# Altium project TS_24 Temperature Module.PrjPcb
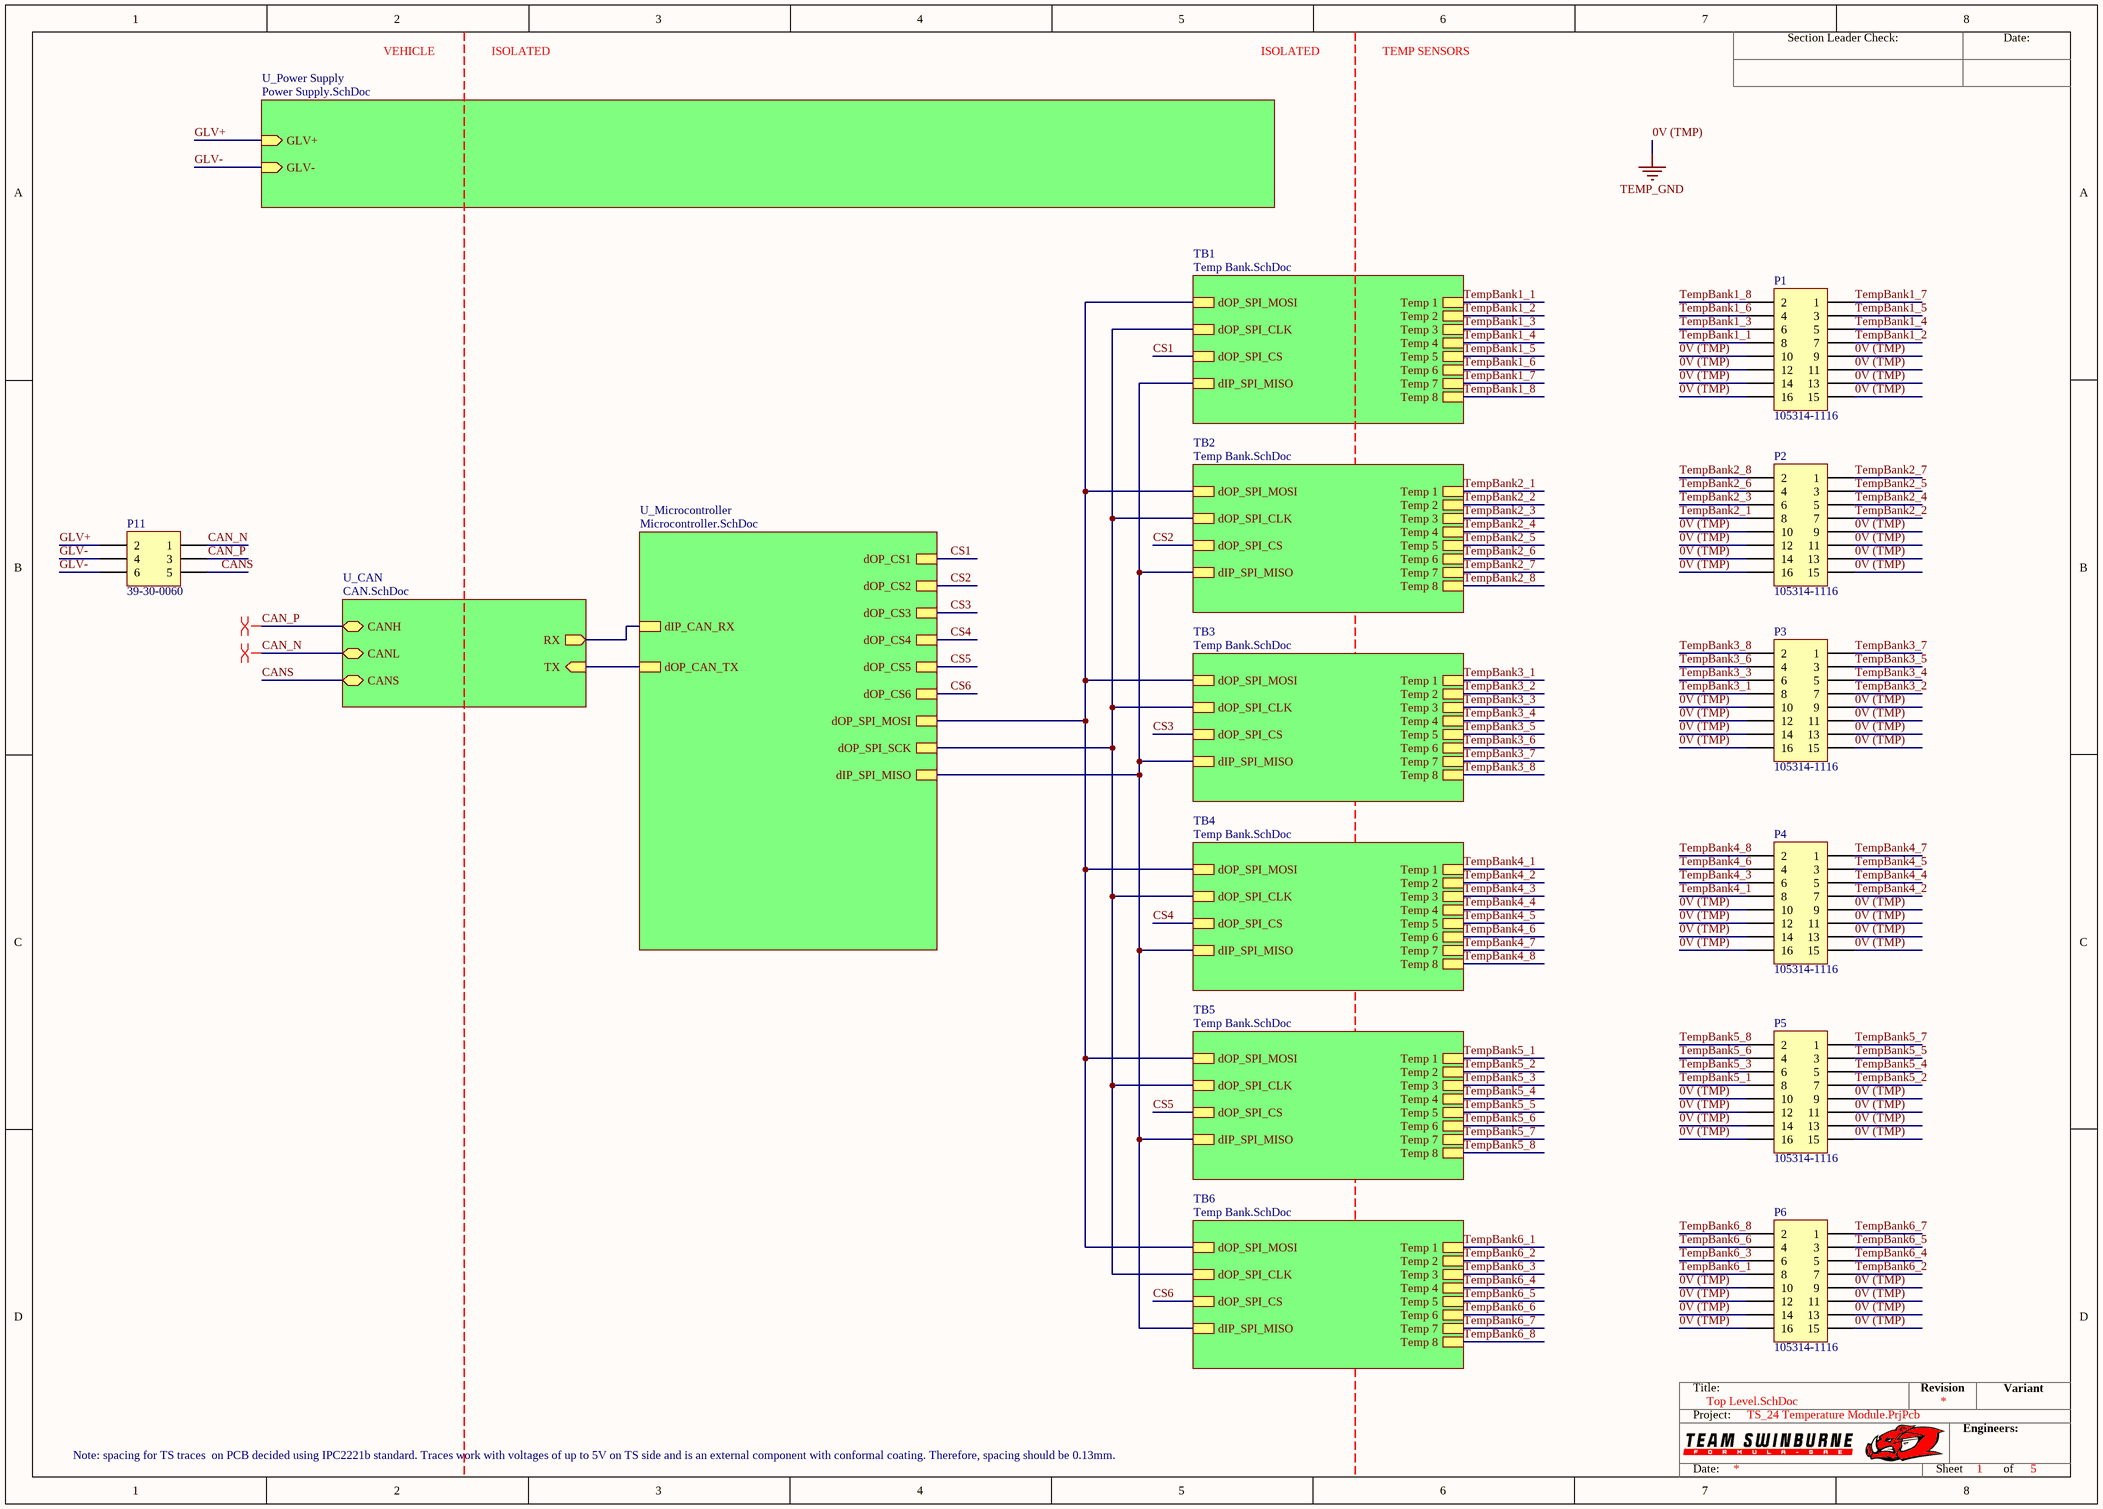
[diagram p0: Top Level.SchDoc]
4 sheets, 59 parts. Net scope: hierarchical (ports join the sheet entries above them; power ports are global).
Board files: Temp Module C1.PcbDoc, Temp Module B1 Sample.PcbDoc
Sheets:
  Top Level.SchDoc
    U_Power Supply = Power Supply.SchDoc
    U_CAN = CAN.SchDoc
    U_Microcontroller = Microcontroller.SchDoc

## Sheet Top Level.SchDoc
size A3; SheetNumber: 1; SheetTotal: 5

### Parts
P1  105314-1116  [105314-1116-Footprint-1]
P2  105314-1116  [105314-1116-Footprint-1]
P3  105314-1116  [105314-1116-Footprint-1]
P4  105314-1116  [105314-1116-Footprint-1]
P5  105314-1116  [105314-1116-Footprint-1]
P6  105314-1116  [105314-1116-Footprint-1]
P11  39-30-0060  [39-30-0060-Footprint-1]

### Sub-sheets
TB1 = Temp Bank.SchDoc (file not in this document): dOP_SPI_MOSI, dOP_SPI_CLK, dOP_SPI_CS, dIP_SPI_MISO, Temp 4, Temp 5, Temp 6, Temp 1, Temp 2, Temp 3, Temp 7, Temp 8
TB2 = Temp Bank.SchDoc (file not in this document): dOP_SPI_MOSI, dOP_SPI_CLK, dOP_SPI_CS, dIP_SPI_MISO, Temp 1, Temp 2, Temp 3, Temp 4, Temp 5, Temp 6, Temp 7, Temp 8
TB3 = Temp Bank.SchDoc (file not in this document): dOP_SPI_MOSI, dOP_SPI_CLK, dOP_SPI_CS, dIP_SPI_MISO, Temp 1, Temp 2, Temp 3, Temp 4, Temp 5, Temp 6, Temp 7, Temp 8
TB4 = Temp Bank.SchDoc (file not in this document): dOP_SPI_MOSI, dOP_SPI_CLK, dOP_SPI_CS, dIP_SPI_MISO, Temp 1, Temp 2, Temp 3, Temp 4, Temp 5, Temp 6, Temp 7, Temp 8
TB5 = Temp Bank.SchDoc (file not in this document): dOP_SPI_MOSI, dOP_SPI_CLK, dOP_SPI_CS, dIP_SPI_MISO, Temp 1, Temp 2, Temp 3, Temp 4, Temp 5, Temp 6, Temp 7, Temp 8
TB6 = Temp Bank.SchDoc (file not in this document): dOP_SPI_MOSI, dOP_SPI_CLK, dOP_SPI_CS, dIP_SPI_MISO, Temp 1, Temp 2, Temp 3, Temp 4, Temp 5, Temp 6, Temp 7, Temp 8
U_CAN = CAN.SchDoc: CANH (bidir), RX (out), TX (in), CANL (bidir), CANS (bidir)
U_Microcontroller = Microcontroller.SchDoc: dOP_CS1, dOP_CS2, dOP_CS3, dOP_CS4, dOP_CS5, dOP_SPI_MOSI, dOP_CS6, dOP_SPI_SCK, dIP_CAN_RX, dOP_CAN_TX, dIP_SPI_MISO
U_Power Supply = Power Supply.SchDoc: GLV+ (in), GLV- (in)

### Nets
0V (TMP): P1.9 P1.10 P1.11 P1.12 P1.13 P1.14 P1.15 P1.16 P2.9 P2.10 P2.11 P2.12 P2.13 P2.14 P2.15 P2.16 P3.9 P3.10 P3.11 P3.12 P3.13 P3.14 P3.15 P3.16 P4.9 P4.10 P4.11 P4.12 P4.13 P4.14 P4.15 P4.16 P5.9 P5.10 P5.11 P5.12 P5.13 P5.14 P5.15 P5.16 P6.9 P6.10 P6.11 P6.12 P6.13 P6.14 P6.15 P6.16  [also labelled TEMP_GND]
CAN_N: P11.1 ; sheet U_CAN/CANL
CAN_P: P11.3 ; sheet U_CAN/CANH
CANS: P11.5 ; sheet U_CAN/CANS
CS1: sheet U_Microcontroller/dOP_CS1, sheet TB1/dOP_SPI_CS
CS2: sheet U_Microcontroller/dOP_CS2, sheet TB2/dOP_SPI_CS
CS3: sheet U_Microcontroller/dOP_CS3, sheet TB3/dOP_SPI_CS
CS4: sheet U_Microcontroller/dOP_CS4, sheet TB4/dOP_SPI_CS
CS5: sheet U_Microcontroller/dOP_CS5, sheet TB5/dOP_SPI_CS
CS6: sheet U_Microcontroller/dOP_CS6, sheet TB6/dOP_SPI_CS
GLV+: P11.2 ; sheet U_Power Supply/GLV+
GLV-: P11.4 P11.6 ; sheet U_Power Supply/GLV-
TempBank1_1: P1.8 ; sheet TB1/Temp 1
TempBank1_2: P1.7 ; sheet TB1/Temp 2
TempBank1_3: P1.6 ; sheet TB1/Temp 3
TempBank1_4: P1.5 ; sheet TB1/Temp 4
TempBank1_5: P1.3 ; sheet TB1/Temp 5
TempBank1_6: P1.4 ; sheet TB1/Temp 6
TempBank1_7: P1.1 ; sheet TB1/Temp 7
TempBank1_8: P1.2 ; sheet TB1/Temp 8
TempBank2_1: P2.8 ; sheet TB2/Temp 1
TempBank2_2: P2.7 ; sheet TB2/Temp 2
TempBank2_3: P2.6 ; sheet TB2/Temp 3
TempBank2_4: P2.5 ; sheet TB2/Temp 4
TempBank2_5: P2.3 ; sheet TB2/Temp 5
TempBank2_6: P2.4 ; sheet TB2/Temp 6
TempBank2_7: P2.1 ; sheet TB2/Temp 7
TempBank2_8: P2.2 ; sheet TB2/Temp 8
TempBank3_1: P3.8 ; sheet TB3/Temp 1
TempBank3_2: P3.7 ; sheet TB3/Temp 2
TempBank3_3: P3.6 ; sheet TB3/Temp 3
TempBank3_4: P3.5 ; sheet TB3/Temp 4
TempBank3_5: P3.3 ; sheet TB3/Temp 5
TempBank3_6: P3.4 ; sheet TB3/Temp 6
TempBank3_7: P3.1 ; sheet TB3/Temp 7
TempBank3_8: P3.2 ; sheet TB3/Temp 8
TempBank4_1: P4.8 ; sheet TB4/Temp 1
TempBank4_2: P4.7 ; sheet TB4/Temp 2
TempBank4_3: P4.6 ; sheet TB4/Temp 3
TempBank4_4: P4.5 ; sheet TB4/Temp 4
TempBank4_5: P4.3 ; sheet TB4/Temp 5
TempBank4_6: P4.4 ; sheet TB4/Temp 6
TempBank4_7: P4.1 ; sheet TB4/Temp 7
TempBank4_8: P4.2 ; sheet TB4/Temp 8
TempBank5_1: P5.8 ; sheet TB5/Temp 1
TempBank5_2: P5.7 ; sheet TB5/Temp 2
TempBank5_3: P5.6 ; sheet TB5/Temp 3
TempBank5_4: P5.5 ; sheet TB5/Temp 4
TempBank5_5: P5.3 ; sheet TB5/Temp 5
TempBank5_6: P5.4 ; sheet TB5/Temp 6
TempBank5_7: P5.1 ; sheet TB5/Temp 7
TempBank5_8: P5.2 ; sheet TB5/Temp 8
TempBank6_1: P6.8 ; sheet TB6/Temp 1
TempBank6_2: P6.7 ; sheet TB6/Temp 2
TempBank6_3: P6.6 ; sheet TB6/Temp 3
TempBank6_4: P6.5 ; sheet TB6/Temp 4
TempBank6_5: P6.3 ; sheet TB6/Temp 5
TempBank6_6: P6.4 ; sheet TB6/Temp 6
TempBank6_7: P6.1 ; sheet TB6/Temp 7
TempBank6_8: P6.2 ; sheet TB6/Temp 8
NetR2_2: sheet U_Microcontroller/dOP_SPI_MOSI, sheet TB1/dOP_SPI_MOSI, sheet TB2/dOP_SPI_MOSI, sheet TB3/dOP_SPI_MOSI, sheet TB4/dOP_SPI_MOSI, sheet TB5/dOP_SPI_MOSI, sheet TB6/dOP_SPI_MOSI
NetR3_2: sheet U_Microcontroller/dIP_SPI_MISO, sheet TB1/dIP_SPI_MISO, sheet TB2/dIP_SPI_MISO, sheet TB3/dIP_SPI_MISO, sheet TB4/dIP_SPI_MISO, sheet TB5/dIP_SPI_MISO, sheet TB6/dIP_SPI_MISO
NetR4_2: sheet U_Microcontroller/dOP_SPI_SCK, sheet TB1/dOP_SPI_CLK, sheet TB2/dOP_SPI_CLK, sheet TB3/dOP_SPI_CLK, sheet TB4/dOP_SPI_CLK, sheet TB5/dOP_SPI_CLK, sheet TB6/dOP_SPI_CLK
NetR29_1: sheet U_CAN/TX, sheet U_Microcontroller/dOP_CAN_TX
NetR30_1: sheet U_CAN/RX, sheet U_Microcontroller/dIP_CAN_RX

### Layout directives
differential pair: CAN_N, CAN_P

### Notes on the sheet
- VEHICLE
- ISOLATED
- TEMP SENSORS
- Note: spacing for TS traces  on PCB decided using IPC2221b standard. Traces work with voltages of up to 5V on TS side and is an external component with conformal coating. Therefore, spacing should be 0.13mm.
- Section Leader Check:
- Date:
- Title:
- Revision
- Variant
- Project:
- Engineers:
- Sheet
- of

### Library data of the parts
P1-P6 = CMP-104-000033-1: Conn Wire to Board HDR 16 POS 2.5mm Solder RA Side Entry Thru-Hole Tray
P11 = CMP-104-000019-1: Rectangular Power Connector, 6 Contact(s), Male, Solder Terminal, Plug; Option: General Purpose; Reference Standard: UL; Mixed Contacts: No; Plating Thickness: 100uin; Body Length: 0.54inch; Dielectric Withstanding Voltage (AC): 1.5kV; Number of Contacts: 6; Mounting Option 1: FRICTION RAMP; Board Mounting Option: PEG; Contact Resistance: 10mR; Insulation Resistance: 1GR; Durability: 30Cycles; Mounting Option 2: LOCKING; Mating Information: MULTIPLE MATING PARTS AVAILABLE; Throw Configuration: S0P6; Number Of Connectors: 1; Body Breadth: 0.38inch; Reliability: COMMERCIAL; Contact Style: SQ PIN-SKT; Body Depth: 0.764inch; Connector Type: Power,Rectangular; Max Operating Temperature: 105°C; Shell Material: POLYAMIDE66; Contact Finish - Termination: Tin (Sn) - with Nickel (Ni) barrier; Flammability Rating: UL94 V-0; JESD-609 Code: e3; Contact Finish - Mating: TIN (200) OVER COPPER; Filter Feature: No; Mounting Technology: Board; Termination: Solder; Mounting Style: RIGHT ANGLE; Terminal Length: 0.14inch; IEC Conformance: No; Empty Shell: No; Contact Gender: Male; DIN Conformance: No; Min Operating Temperature: -40°C; Insulation Color: Natural; Contact Material: Brass; Reach SVHC Compliant: Yes; RoHS Compliant: Yes; Insulation Material: Nylon; MIL Conformance: No; Body/Shell Style: PLUG

## Sheet Power Supply.SchDoc
size A4; SheetNumber: 2; SheetTotal: 5
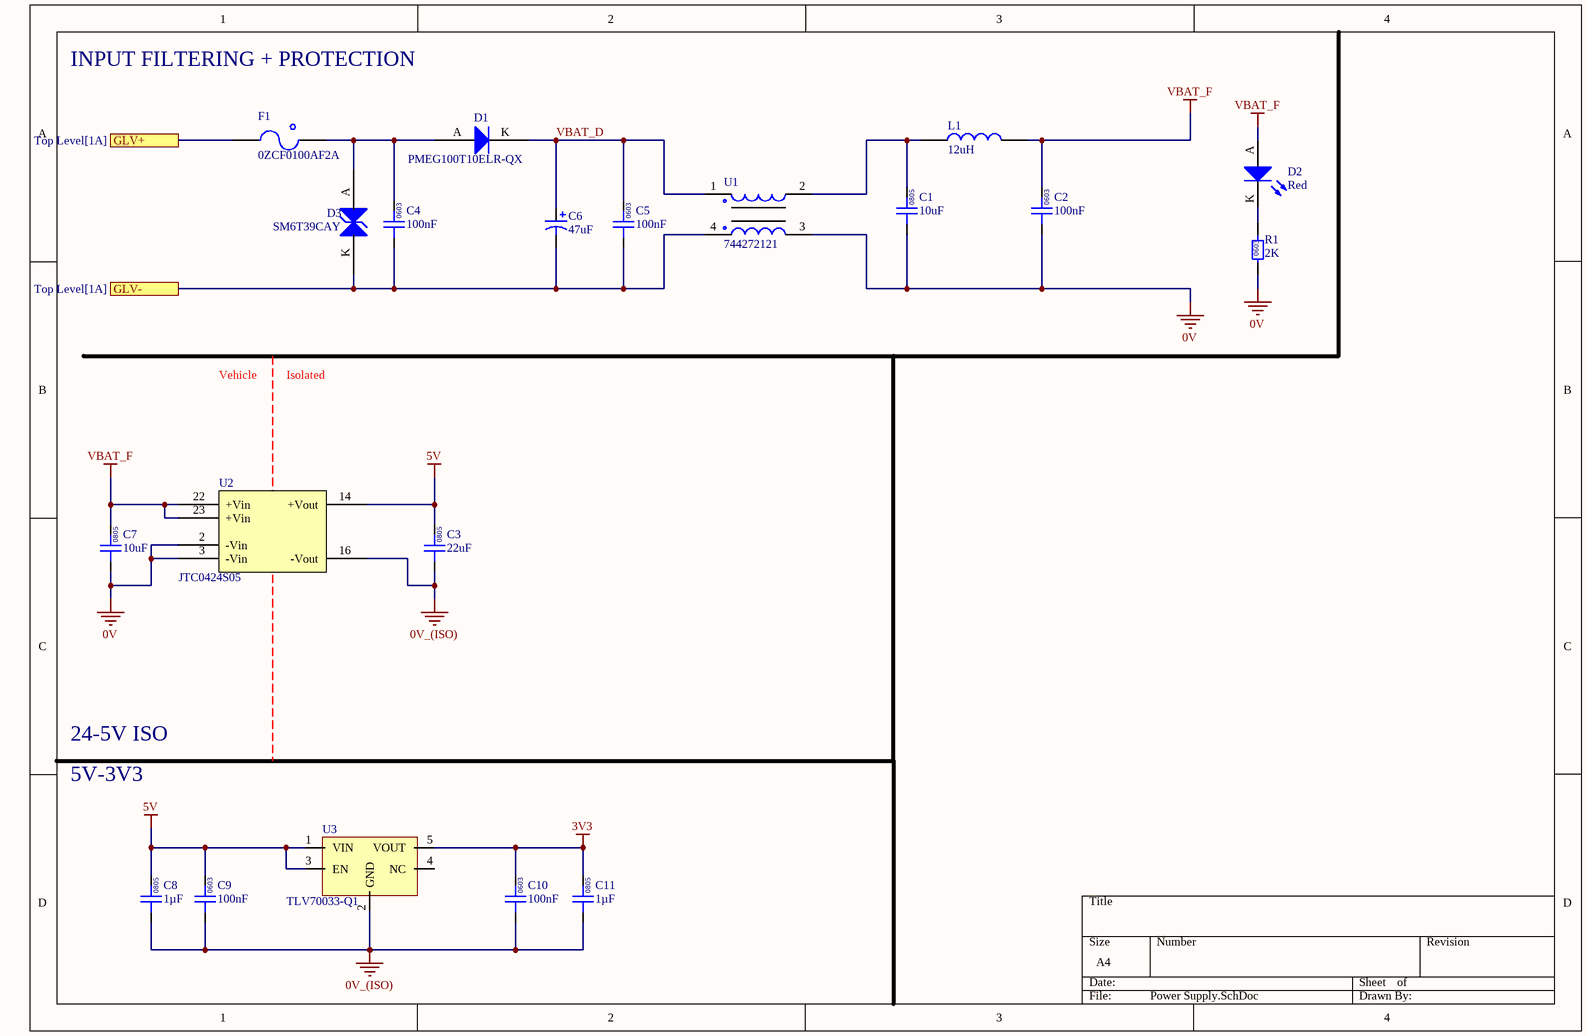
[diagram p1: Power Supply.SchDoc]

### Parts
C1  10uF  [0805]
C2  100nF  [0603]
C3  22uF  [0805]
C4  100nF  [0603]
C5  100nF  [0603]
C6  47uF  [CHEMI-CON ELCO]
C7  10uF  [0805]
C8  1µF  [0805]
C9  100nF  [0603]
C10  100nF  [0603]
C11  1µF  [0805]
D1  PMEG100T10ELR-QX  [SODFL350X110-2N]
D2  Red  [0805 LED]
D3  SM6T39CAY  [SM6T39CAY-Footprint-1]
F1  0ZCF0100AF2A  [2920]
L1  12uH  [1812]
R1  2K  [0603]
U1  744272121  [Wurth 4-PC Pad]
U2  JTC0424S05  [24-DIP Module, 7 Leads]
U3  TLV70033-Q1  [TI SOT-23-5]

### Ports
GLV+ (see Top Level[1A]), GLV- (see Top Level[1A])

### Nets
0V: C1.1 C2.1 C7.1 R1.1 U1.3 U2.2(-Vin) U2.3(-Vin)
0V_(ISO): C3.1 C8.1 C9.1 C10.1 C11.1 U2.16(-Vout) U3.2(GND)
3V3: C10.2 C11.2 U3.5(VOUT)
5V: C3.2 C8.2 C9.2 U2.14(+Vout) U3.1(VIN) U3.3(EN)
VBAT_F: C2.2 C7.2 D2.A L1.1 U2.22(+Vin) U2.23(+Vin)
GLV+: F1.1 ; port GLV+
GLV-: C4.1 C5.1 C6.1 D3.K U1.4 ; port GLV-
VBAT_D: C5.2 C6.2 D1.K U1.1
NetC1_2: C1.2 L1.2 U1.2
NetC4_2: C4.2 D1.A D3.A F1.2
NetD2_K: D2.K R1.2

Not connected (* = marked no-connect by the designer): U3 4(NC)

### Notes on the sheet
- INPUT FILTERING + PROTECTION
- Vehicle
- Isolated
- 24-5V ISO
- 5V-3V3
- (in symbol GCM21BR71H105KA03L) 0805
- (in symbol GCM188L81H104KA57D) 0603
- (in symbol GRM21BR6YA106KE43L) 0805
- (in symbol GRM21BR61A226ME51L) 0805
- (in symbol RC0603FR-072KL) 0603

### Library data of the parts
C1 C7 = GRM21BR6YA106KE43L: Manufacturer: muRata; Rated Voltage: 50V; Tolerance: 10%; Material: MLCC; Temperature Rating: X5R; Part Number: GRM21BR6YA106KE43L; Value: 10uF; Digikey Part Number: 490-10514-6-ND
C2 C4 C5 C9 C10 = GCM188L81H104KA57D: Manufacturer: muRata; Rated Voltage: 50V; Tolerance: ±10%; Material: MLCC; Temperature Rating: X8L; Part Number: GCM188L81H104KA57D; Value: 100nF; Digikey Part Number: 490-6049-1-ND
C3 = GRM21BR61A226ME51L: Manufacturer: muRata; Rated Voltage: 10V; Tolerance: 20%; Material: MLCC; Temperature Rating: X5R; Part Number: GRM21BR61A226ME51L; Value: 22uF; Digikey Part Number: 490-10511-1-ND
C6 = HHXA350ARA470MF61G: Part Number: HHXA350ARA470MF61G
C8 C11 = GCM21BR71H105KA03L: Manufacturer: muRata; Rated Voltage: 50V; Tolerance: ±10%; Material: MLCC; Temperature Rating: X7R; Part Number: GCM21BR71H105KA03L; Value: 1µF; Digikey Part Number: 490-10675-1-ND
D1 = CMP-004-00005-4: Diode 100 V 1A Surface Mount SOD-123W
D2 = SML-210LTT86: Red LED Indication - Discrete 1.75V 0805 (2012 Metric); Manufacturer: ROHM Semiconductor; Part Number: SML-210LTT86; Colour: Red; Digikey Part Number: 511-1286-1-ND
D3 = CMP-004-00003-4: TVS Diode Single Bi-Dir 33.3V 600W Automotive 2-Pin SMB T/R / TVS DIODE 33.3VWM 69.7VC SMB; Peak Pulse Current: 57A; Polarity: Bidirectional; Min Breakdown Voltage: 37.1V; Test Current: 1mA; Number of Elements: 1; Operating Supply Voltage: 30V; Diode Type: ZENER; Clamping Voltage: 53.9V; Leakage Current: 200nA; Power Line Protection: No; Max Surge Current: 11.1A; Max Breakdown Voltage: 41V; Breakdown Voltage: 39V; Max Power Dissipation: 600W; Radiation Hardening: No; Resistor Type: Zener; Termination: SMD/SMT; REACH SVHC: No SVHC; Reverse Breakdown Voltage: 37.1V; Max Operating Temperature: 150°C; Min Operating Temperature: -55°C; Element Configuration: Single; Length: 4.6mm; Case/Package: DO-214AA; Reverse Standoff Voltage: 33.3V; Number of Bidirectional Channels: 1; Number of Pins: 2; Direction: Bidirectional; Mount: Surface Mount; Package Quantity: 1; Width: 3.95mm; RoHS Compliant: Yes; Number of Channels: 1; Packaging: Tape and Reel; Max Reverse Leakage Current: 200nA; Peak Pulse Power: 600W; Height: 2.45mm; Series: Automotive, AEC-Q101, SM6TY, TRANSIL™
F1 = 0ZCF0100AF2A: PTC RESET FUSE 60V 1A 292; Manufacturer: Littelfuse Inc.; Part Number: 0ZCF0100AF2A; Digikey Part Number: 507-2070-1-ND; Digikey Link: https://www.digikey.com/product-detail/en/bel-fuse-inc/0ZCF0100AF2A/507-2070-1-ND/6210547
L1 = RLS-126: Manufacturer: Recom; Tolerance: 0.2; Impedance: 230mOhm; Rated Current: 0.8 A; Material: Wirewound; Part Number: RLS-126; Value: 12uH; Digikey Part Number: 945-3429-ND
R1 = RC0603FR-072KL: Manufacturer: YAGEO; Tolerance: 0.01; Rated Power: 0.1W; Part Number: RC0603FR-072KL; Value: 2K; Digikey Part Number: 311-2.00KHRCT-ND; Material: FR-07
U1 = 744272121: Manufacturer: Wurth Electronics Inc; Value: 120uH @ 100kHz; Impedance: 460 Ohms @ 30MHz; Rated Current: 2.5 A; Part Number: 744272121; Material: Wirewound; Digikey Part Number: 732-1489-1-ND
U2 = JTC0424S05: DC DC CONVERTER 5V 4W; Manufacturer: XP Power; Input Voltage: 9V-36V; Efficiency: 0.79; Isolation: Isolated; Part Number: JTC0424S05; Output Voltage: 5V; Output Power: 4W; Digikey Part Number: JTC0424S05-ND; Digikey Link: https://www.digikey.com/products/en?keywords=%20JTC0424S05
U3 = TLV70033-Q1: IC REG LINEAR 3.3V 200MA SOT23-5; Manufacturer: Texas Instruments; Input Voltage: 2 to 5.5 V; Output Current: 0.2 A; Part Number: TLV70033-Q1; Output Voltage: 3.3 V; Digikey Part Number: 296-27780-1-ND

## Sheet CAN.SchDoc
size A4; SheetNumber: 4; SheetTotal: 5
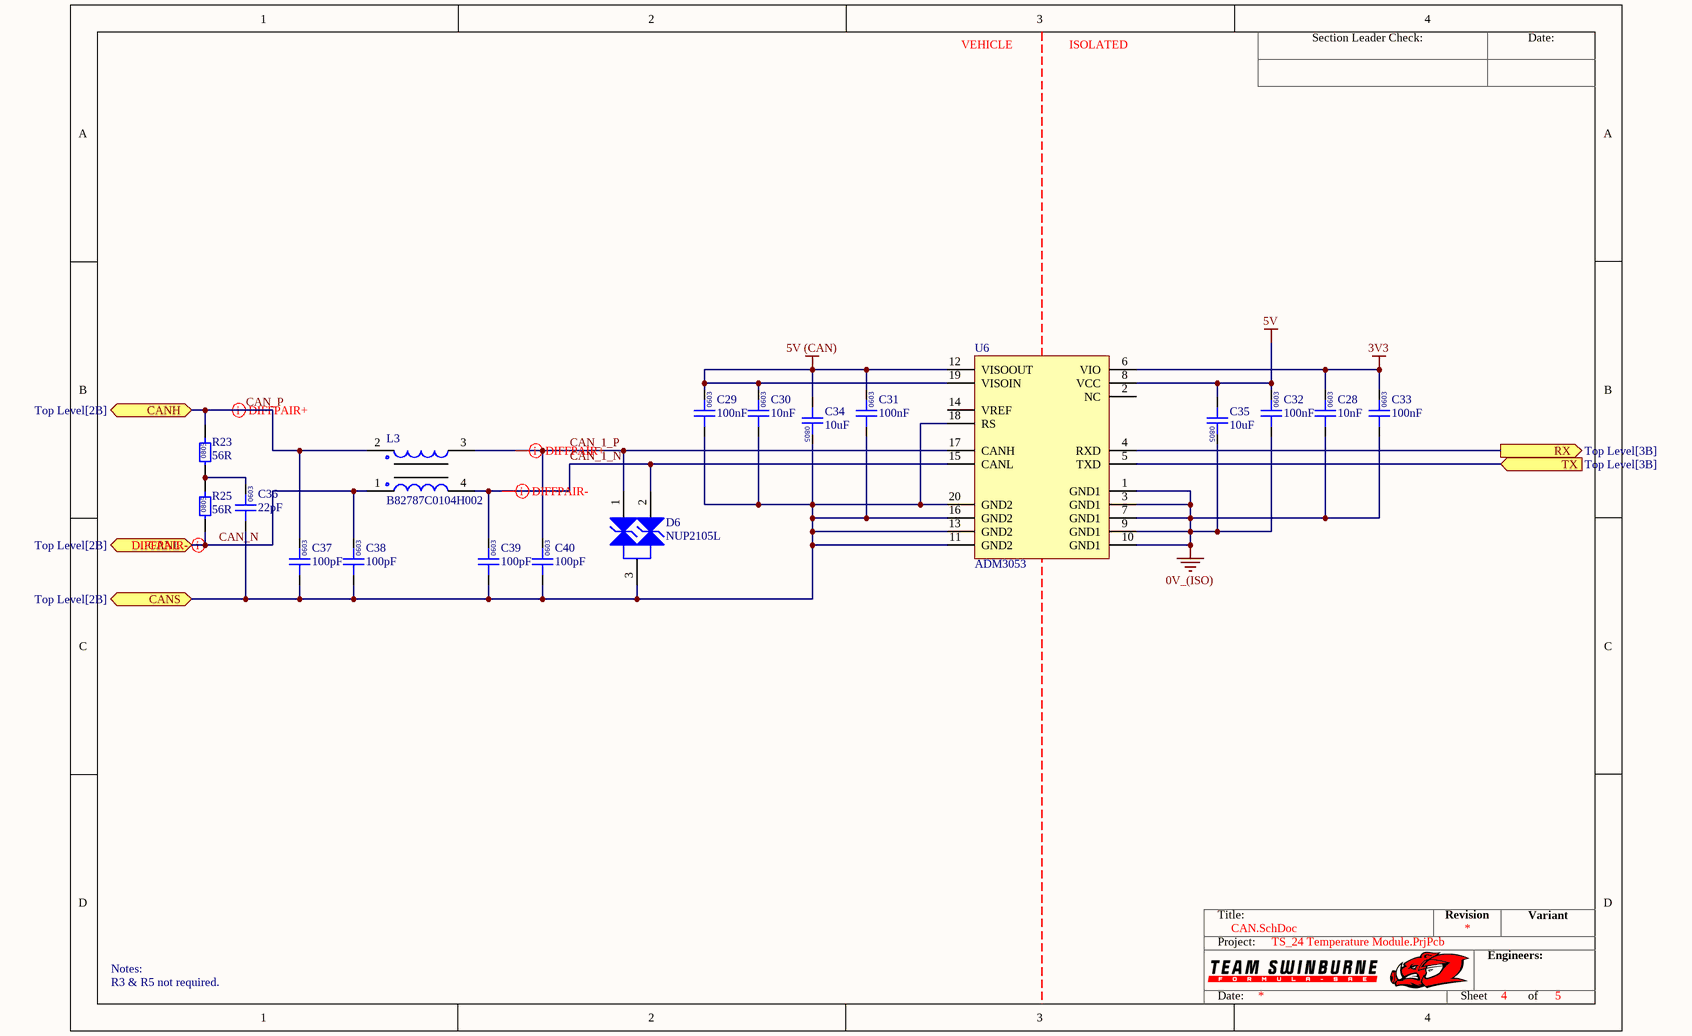
[diagram p2: CAN.SchDoc]

### Parts
C28  10nF  [0603]
C29  100nF  [0603]
C30  10nF  [0603]
C31  100nF  [0603]
C32  100nF  [0603]
C33  100nF  [0603]
C34  10uF  [0805]
C35  10uF  [0805]
C36  22pF  [0603]
C37  100pF  [0603]
C38  100pF  [0603]
C39  100pF  [0603]
C40  100pF  [0603]
D6  NUP2105L  [ONSC-SOT-23-3-318-08_V]
L3  B82787C0104H002  [TDK 4-PC Pad]
R23  56R  [0805]
R25  56R  [0805]
U6  ADM3053  [AD SOIC-W 20]

### Ports
CANH (bidir, see Top Level[2B]), CANL (bidir, see Top Level[2B]), CANS (bidir, see Top Level[2B]), RX (out, see Top Level[3B]), TX (in, see Top Level[3B])

### Nets
0V_(ISO): C28.1 C32.1 C33.1 C35.2 U6.1(GND1) U6.3(GND1) U6.7(GND1) U6.9(GND1) U6.10(GND1)
3V3: C28.2 C33.2 U6.6(VIO)
5V: C32.2 C35.1 U6.8(VCC)
5V (CAN): C29.2 C30.2 C31.2 C34.1 U6.12(VISOOUT) U6.19(VISOIN)
CAN_1_N: C39.2 D6.2(K) L3.4 U6.15(CANL)
CAN_1_P: C40.2 D6.1(K) L3.3 U6.17(CANH)
CAN_N: C38.2 L3.1 R25.1 ; port CANL
CAN_P: C37.2 L3.2 R23.2 ; port CANH
CANS: C29.1 C30.1 C31.1 C34.2 C36.1 C37.1 C38.1 C39.1 C40.1 D6.3(K) U6.11(GND2) U6.13(GND2) U6.16(GND2) U6.18(RS) U6.20(GND2) ; port CANS
NetC36_2: C36.2 R23.1 R25.2
NetR29_1: U6.5(TXD) ; port TX
NetR30_1: U6.4(RXD) ; port RX

Not connected (* = marked no-connect by the designer): U6 2(NC) 14(VREF)

### Layout directives
differential pair: CAN_1_N, CAN_1_P, CAN_N, CAN_P

### Notes on the sheet
- VEHICLE
- ISOLATED
- Notes:
- R3 & R5 not required.
- Section Leader Check:
- Date:
- Title:
- Revision
- Variant
- Project:
- Engineers:
- Sheet
- of
- (in symbol GCM188L81H103KA03D) 0603
- (in symbol GCM188L81H104KA57D) 0603
- (in symbol GRM21BR6YA106KE43L) 0805
- (in symbol GRM0335C1H220JA01D) 0603
- (in symbol GRM1885C1H101JA01D) 0603
- (in symbol RC0805FR0756RL) 0805

### Library data of the parts
C28 C30 = GCM188L81H103KA03D: Manufacturer: muRata; Rated Voltage: 50V; Tolerance: ±10%; Material: MLCC; Temperature Rating: X8L; Part Number: GCM188L81H103KA03D; Value: 10nF; Digikey Part Number: 490-GCM188L81H103KA03DCT-ND
C29 C31-C33 = GCM188L81H104KA57D: as C2 on sheet Power Supply; Part Number: GCM188L81H104KA57D; Value: 100nF; Digikey Part Number: 490-6049-1-ND
C34 C35 = GRM21BR6YA106KE43L: as C1 on sheet Power Supply; Part Number: GRM21BR6YA106KE43L; Value: 10uF; Digikey Part Number: 490-10514-6-ND
C36 = GRM0335C1H220JA01D: Manufacturer: Murata Electronics; Rated Voltage: 50V; Tolerance: ±5%; Material: MLCC; Temperature Rating: C0G, NP0; Part Number: GRM0335C1H220JA01D; Value: 22pF; Digikey Part Number: 490-6123-1-ND
C37-C40 = GRM1885C1H101JA01D: Manufacturer: Murata Electronics; Rated Voltage: 50V; Tolerance: ±5%; Material: MLCC; Temperature Rating: C0G, NP0; Part Number: GRM1885C1H101JA01D; Value: 100pF; Digikey Part Number: 490-1427-1-ND
D6 = CMP-004-00000-1: NUP2105L Series 350 W Dual Line CAN Bus Protector ESD Protection Diode - SOT-23; Max Breakdown Voltage: 32V; Clamping Voltage: 44V; Number of Lines: 2; Direction: Bidirectional; Reverse Standoff Voltage: 24V; Min Breakdown Voltage: 26.2V; Peak Pulse Current: 8A; ESD Protection: Yes; Test Current: 1mA; Diode Type: ZENER; Max Power Dissipation: 350W; Capacitance: 30pF; Leakage Current: 100nA; Power Line Protection: No; Depth: 1.3mm; Package Quantity: 1; Element Configuration: Dual; Termination: SMD/SMT; Radiation Hardening: No; Min Operating Temperature: -55°C; Contact Plating: Tin,Matte; Packaging: Tape and Reel; Polarity: Bidirectional; Resistor Type: Zener; Clamping Voltage-Max: 44V; Height: 0.94mm; Max Surge Current: 8A; RoHS Compliant: Yes; Width: 1.3mm; Lead Free: Lead Free; Case/Package: SOT-23-3; Number of Channels: 2; Series: Automotive, AEC-Q101; Halogen Free: Halogen Free; Breakdown Voltage: 26.2V; Working Voltage: 24V; Operating Supply Voltage: 24V; Max Operating Temperature: 150°C; REACH SVHC: No SVHC; Number of Pins: 3; Max Reverse Leakage Current: 100nA; Peak Pulse Power: 350W; Length: 2.9mm; Number of Bidirectional Channels: 2
L3 = B82787C0104H002: Manufacturer: EPCOS (TDK); Value: 100µH @ 100kHz; Impedance: 5.8 kOhms @ 10MHz; Rated Current: 150mA; Material: Wirewound; Part Number: B82787C0104H002; Digikey Part Number: 495-4598-1-ND
R23 R25 = RC0805FR0756RL: Manufacturer: YAGEO; Tolerance: 0.01; Rated Power: 0.125W; Part Number: RC0805FR0756RL; Value: 56R; Material: FR-07; Digikey Part Number: 311-56.0CRCT-ND
U6 = ADM3053: Isolated CAN Transceiver; Manufacturer: Analogue Devices; Complex IC: 1; Part Number: ADM3053; Digikey Part Number: ADM3053BRWZ-ND; Digikey Link: https://www.digikey.com/product-detail/en/analog-devices-inc/ADM3053BRWZ/ADM3053BRWZ-ND/2709332

## Sheet Microcontroller.SchDoc
size A4; SheetNumber: 5; SheetTotal: 5
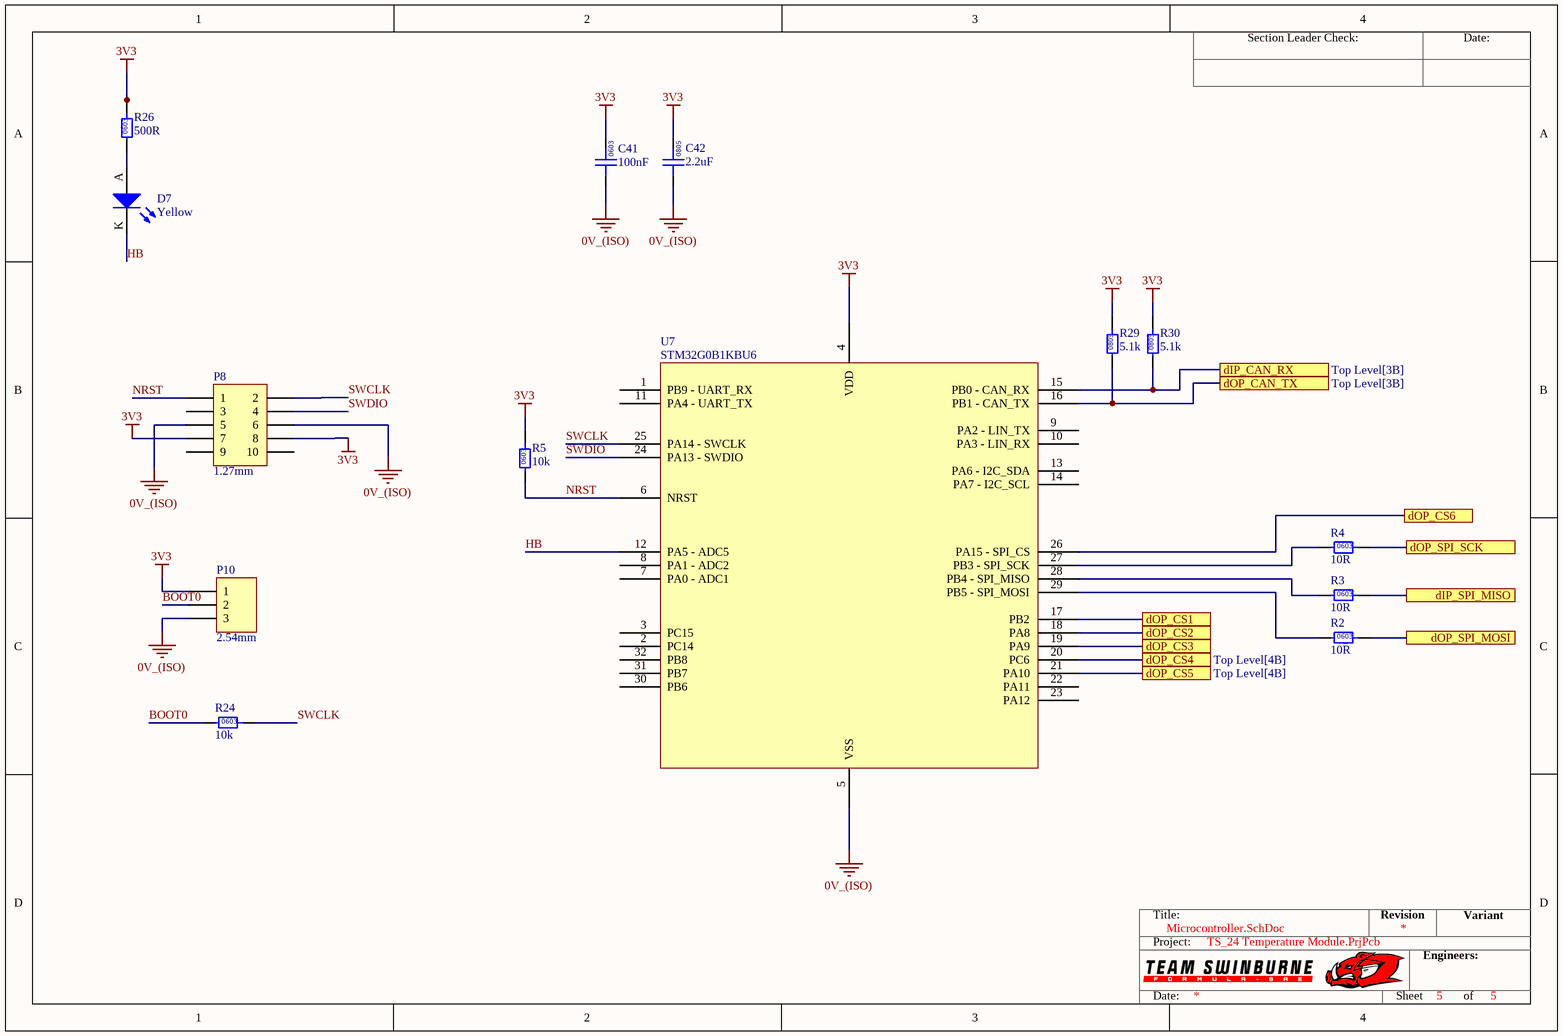
[diagram p3: Microcontroller.SchDoc]

### Parts
C41  100nF  [0603 Capacitor]
C42  2.2uF  [GCM21BR71H105KA03L-Footprint-1]
D7  Yellow  [0805 LED]
P8  1.27mm  [3221-10-0300-00]
P10  2.54mm  [TH 2.54mm Header 1x3]
R2  10R  [0603]
R3  10R  [0603]
R4  10R  [0603]
R5  10k  [0603]
R24  10k  [0603]
R26  500R  [0603]
R29  5.1k  [0805]
R30  5.1k  [0805]
U7  STM32G0B1KBU6  [ST-UFQFPN32]

### Ports
dIP_CAN_RX (see Top Level[3B]), dIP_SPI_MISO (see Top Level[4C], Temp Bank[1C]), dOP_CAN_TX (see Top Level[3B]), dOP_CS1 (see Top Level[4B]), dOP_CS2 (see Top Level[4B]), dOP_CS3 (see Top Level[4B]), dOP_CS4 (see Top Level[4B]), dOP_CS5 (see Top Level[4B]), dOP_CS6 (see Top Level[4B]), dOP_SPI_MOSI (see Top Level[4B], Temp Bank[1C]), dOP_SPI_SCK (see Top Level[4B])

### Nets
0V_(ISO): C41.1 C42.1 P8.5 P8.6 P10.3 U7.5(VSS)
3V3: C41.2 C42.2 P8.7 P8.8 P10.1 R5.2 R26.2 R29.2 R30.2 U7.4(VDD)
BOOT0: P10.2 R24.1
CS1: U7.17(PB2) ; port dOP_CS1
CS2: U7.18(PA8) ; port dOP_CS2
CS3: U7.19(PA9) ; port dOP_CS3
CS4: U7.20(PC6) ; port dOP_CS4
CS5: U7.21(PA10) ; port dOP_CS5
CS6: U7.26(PA15_-_SPI_CS) ; port dOP_CS6
HB: D7.K U7.12(PA5_-_ADC5)
NRST: P8.1 R5.1 U7.6(NRST)
SWCLK: P8.2 R24.2 U7.25(PA14_-_SWCLK)
SWDIO: P8.4 U7.24(PA13_-_SWDIO)
NetD7_A: D7.A R26.1
NetR2_1: R2.1 U7.29(PB5_-_SPI_MOSI)
NetR2_2: R2.2 ; port dOP_SPI_MOSI
NetR3_1: R3.1 U7.28(PB4_-_SPI_MISO)
NetR3_2: R3.2 ; port dIP_SPI_MISO
NetR4_1: R4.1 U7.27(PB3_-_SPI_SCK)
NetR4_2: R4.2 ; port dOP_SPI_SCK
NetR29_1: R29.1 U7.16(PB1_-_CAN_TX) ; port dOP_CAN_TX
NetR30_1: R30.1 U7.15(PB0_-_CAN_RX) ; port dIP_CAN_RX

Not connected (* = marked no-connect by the designer): P8 3 9 10; U7 1(PB9_-_UART_RX) 2(PC14) 3(PC15) 7(PA0_-_ADC1) 8(PA1_-_ADC2) 9(PA2_-_LIN_TX) 10(PA3_-_LIN_RX) 11(PA4_-_UART_TX) 13(PA6_-_I2C_SDA) 14(PA7_-_I2C_SCL) 22(PA11) 23(PA12) 30(PB6) 31(PB7) 32(PB8)

### Notes on the sheet
- Section Leader Check:
- Date:
- Title:
- Revision
- Variant
- Project:
- Engineers:
- Sheet
- of
- (in symbol CMP-102-000031-7) 0603
- (in symbol CMP-102-000032-2) 0805
- (in symbol RC0603FR-0710KL) 0603
- (in symbol RC0603FR-0710RL) 0603
- (in symbol RC0805FR075K1L) 0805
- (in symbol RT0603BRD07500RL) 0603
- (in symbol GCM21BR71H105KA03L) 0805
- (in symbol GCM188L81H104KA57D) 0603

### Library data of the parts
C41 = CMP-102-000031-7: Ceramic Capacitor, Multilayer, Ceramic, 50V, 10% +Tol, 10% -Tol, X8L, -40/+15% TC, 0.1uF, Surface Mount, 0603; Part Number: GCM188L81H104KA57D; Material: X8L; Digikey Link: https://www.digikey.com.au/en/products/detail/murata-electronics/GCM188L81H104KA57D/2591908?s=N4IgTCBcDaIOIGECyBGAHGgMmlAJFADACwDSAggKwDsAIiALoC%2BQA; Rated Voltage: 50V; Tolerance: 10%; Value: 100nF
C42 = CMP-102-000032-2: Ceramic Capacitor, Multilayer, Ceramic, 25V, 10% +Tol, 10% -Tol, X7R, 15% TC, 2.2uF, Surface Mount, 0805; Part Number: GRM21BR71E225KE11L; Rated Voltage: 50V; Value: 2.2µF; Material: X7R; Tolerance: 10%; Digikey Link: https://www.digikey.com.au/en/products/detail/murata-electronics/GRM21BR71E225KE11L/6606096?s=N4IgTCBcDaIOICUCyYCMAhBB2VBRMYArANK6qoAyIAugL5A
D7 = SML-211YTT86: Yellow LED Indication - Discrete 1.75V 0805 (2012 Metric); Manufacturer: ROHM Semiconductor; Part Number: SML-211YTT86; Colour: Yellow; Digikey Part Number: 511-1293-1-ND
P8 = SMD 1.27mm Header 2x5 (3221-10-0300-00): Positions: 10; Angle: 0; Flange: No; Contact: NA; Part Number: SMD 1.27mm Header 2x5 (3221-10-0300-00); Pitch: 1.27mm; Row Spacing: 1.27mm
P10 = TH 2.54mm Header 1x3: Positions: 3; Angle: 0; Flange: No; Contact: NA; Part Number: TH 2.54mm Header 1x3; Pitch: 2.54mm; Row Spacing: 2.54mm
R2-R4 = RC0603FR-0710RL: Manufacturer: YAGEO; Tolerance: 0.01; Rated Power: 0.1W; Part Number: RC0603FR-0710RL; Value: 10R; Material: FR-07; Digikey Part Number: 311-10.0HRCT-ND
R5 R24 = RC0603FR-0710KL: Manufacturer: YAGEO; Tolerance: 0.01; Rated Power: 0.1W; Part Number: RC0603FR-0710KL; Value: 10k; Digikey Part Number: 311-10.0KHRCT-ND; Material: FR-07
R26 = RT0603BRD07500RL: Manufacturer: YAGEO; Tolerance: 0.01; Rated Power: 0.1W; Part Number: RT0603BRD07500RL; Value: 500R; Material: FR-07; Digikey Part Number: 13-RT0603BRD07500RL-ND
R29 R30 = RC0805FR075K1L: Manufacturer: YAGEO; Tolerance: 0.01; Rated Power: 0.125W; Part Number: RC0805FR075K1L; Value: 5.1k; Material: FR-07; Digikey Part Number: 311-5.10KCRCT-ND
U7 = CMP-029-000004-2: RISC Microcontroller, 32-Bit, FLASH, Cortex-M0+ CPU, 64MHz, CMOS

## Nets that join several sheets
0V_(ISO): Power Supply (7 pins), CAN (9 pins), Microcontroller (6 pins)
3V3: Power Supply (C10.2 C11.2 U3.5), CAN (C28.2 C33.2 U6.6), Microcontroller (10 pins)
5V: Power Supply (6 pins), CAN (C32.2 C35.1 U6.8)
CAN_N: Top Level (P11.1), CAN (C38.2 L3.1 R25.1)
CAN_P: Top Level (P11.3), CAN (C37.2 L3.2 R23.2)
CANS: Top Level (P11.5), CAN (15 pins)
GLV+: Top Level (P11.2), Power Supply (F1.1)
GLV-: Top Level (P11.4 P11.6), Power Supply (5 pins)
NetR29_1: CAN (U6.5), Microcontroller (R29.1 U7.16)
NetR30_1: CAN (U6.4), Microcontroller (R30.1 U7.15)